# Altium project CW313_20pinToTarget.PrjPcb
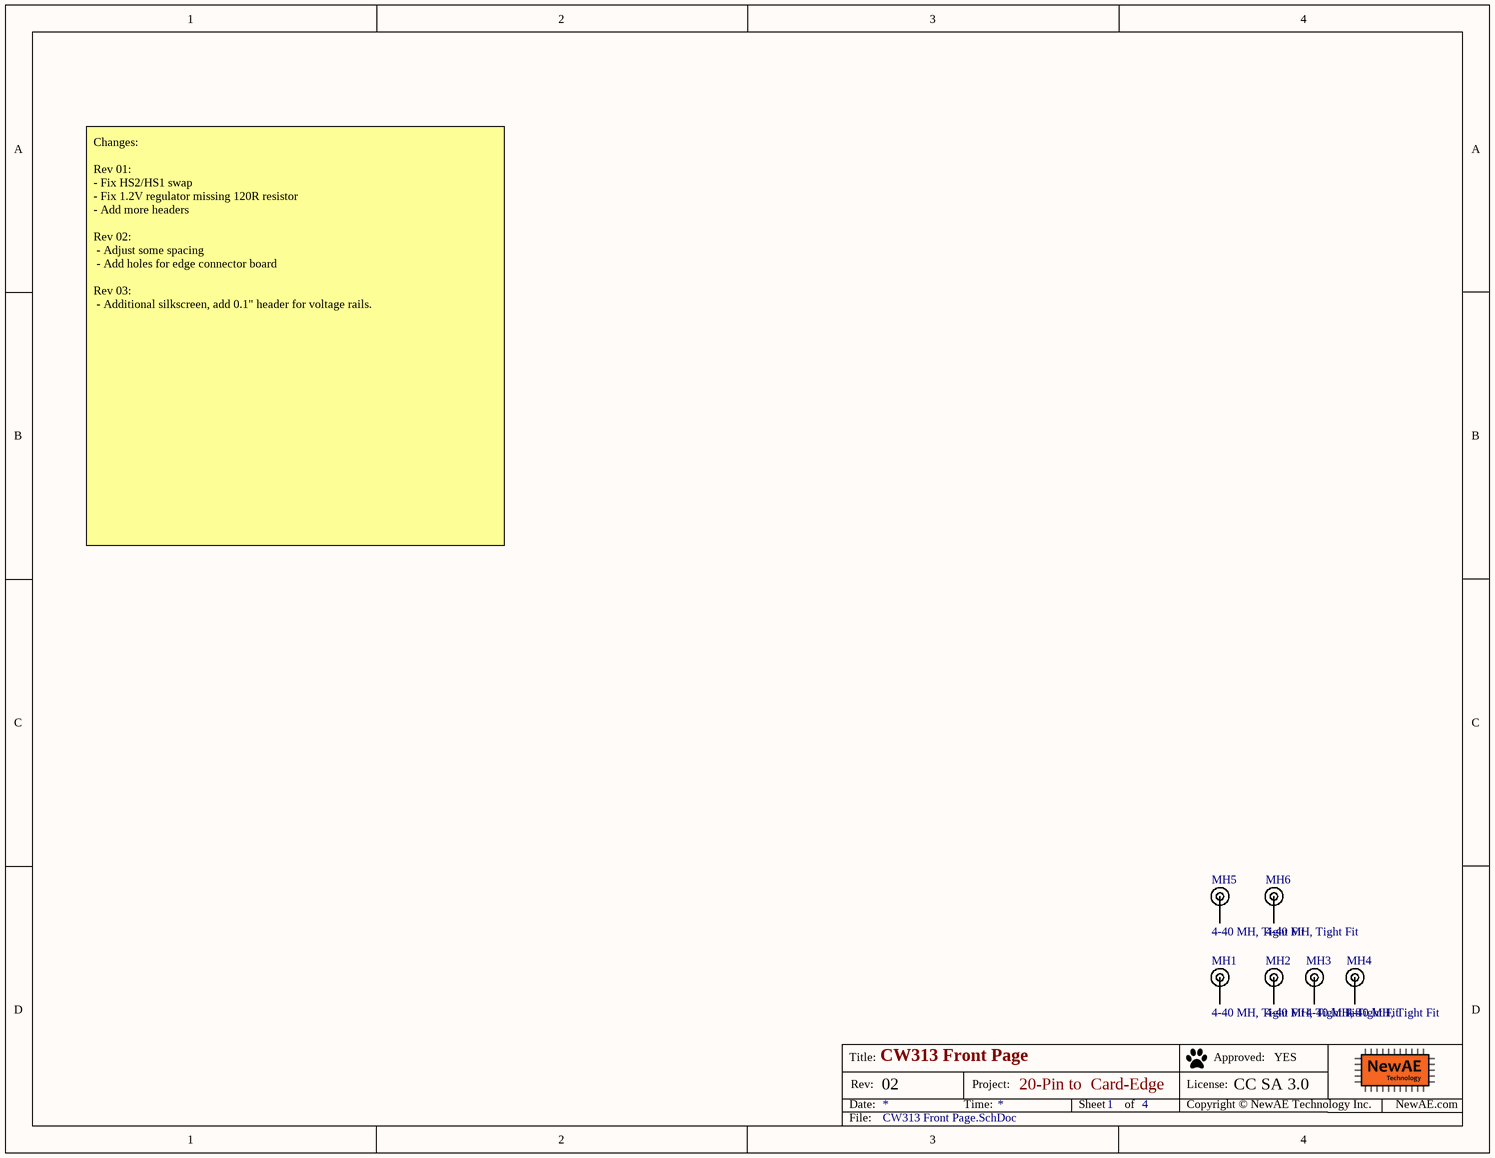
[diagram p0: CW313 Front Page.SchDoc]
PrjLicense: CC SA 3.0; PrjName: 20-Pin to  Card-Edge; PrjRev: 02
4 sheets, 81 parts. Net scope: global (net labels, ports and power ports of the same name join across sheets).
Board file: CW313.PcbDoc
Sheets:
  CW313 Front Page.SchDoc
  CW313 PCIe Edge.SchDoc
  CW313 Power Supplies.SchDoc
  CW313 20 Pin Connector.SchDoc

## Sheet CW313 Front Page.SchDoc: CW313 Front Page
size Letter; Organization: NewAE Technology Inc.; Address1: 1083 Queen St., Suite 196; Address2: Halifax; Address3: NS; Address4: Canada B3H 0B2; SheetNumber: 1; SheetTotal: 4; SheetApproved: YES

### Parts
MH1  4-40 MH, Tight Fit  [MOUNT_#4_TIGHT]
MH2  4-40 MH, Tight Fit  [MOUNT_#4_TIGHT]
MH3  4-40 MH, Tight Fit  [MOUNT_#4_TIGHT]
MH4  4-40 MH, Tight Fit  [MOUNT_#4_TIGHT]
MH5  4-40 MH, Tight Fit  [MOUNT_#4_TIGHT]
MH6  4-40 MH, Tight Fit  [MOUNT_#4_TIGHT]

### Nets

Not connected (* = marked no-connect by the designer): MH1 1; MH2 1; MH3 1; MH4 1; MH5 1; MH6 1

### Notes on the sheet
- Changes:
  Rev 01:
  - Fix HS2/HS1 swap
  - Fix 1.2V regulator missing 120R resistor
  - Add more headers
  Rev 02:
  - Adjust some spacing
  - Add holes for edge connector board
  Rev 03:
  - Additional silkscreen, add 0.1" header for voltage rails.
- Title:
- Date:
- Rev:
- Time:
- Project:
- Sheet
- of
- License:
- Copyright © NewAE Technology Inc.
- Approved:
- NewAE.com
- File:

### Library data of the parts
MH1-MH6 = MOUNT_#4_TIGHT: Machine screw 4-40 Mounting Hole; Component Group: Mechanical; PP Material Stack: 0; Part Number: MOUNT_#4_TIGHT; Pin Count: 1; Component Kind: Mechanical; Component Type: Mechanical; PP Rotation: 0

## Sheet CW313 PCIe Edge.SchDoc: Card Edge Connector + Headers
size Letter; Organization: NewAE Technology Inc.; Address1: 1083 Queen St., Suite 196; Address2: Halifax; Address3: NS; Address4: Canada B3H 0B2; SheetNumber: 2; SheetTotal: 4; SheetApproved: Yes
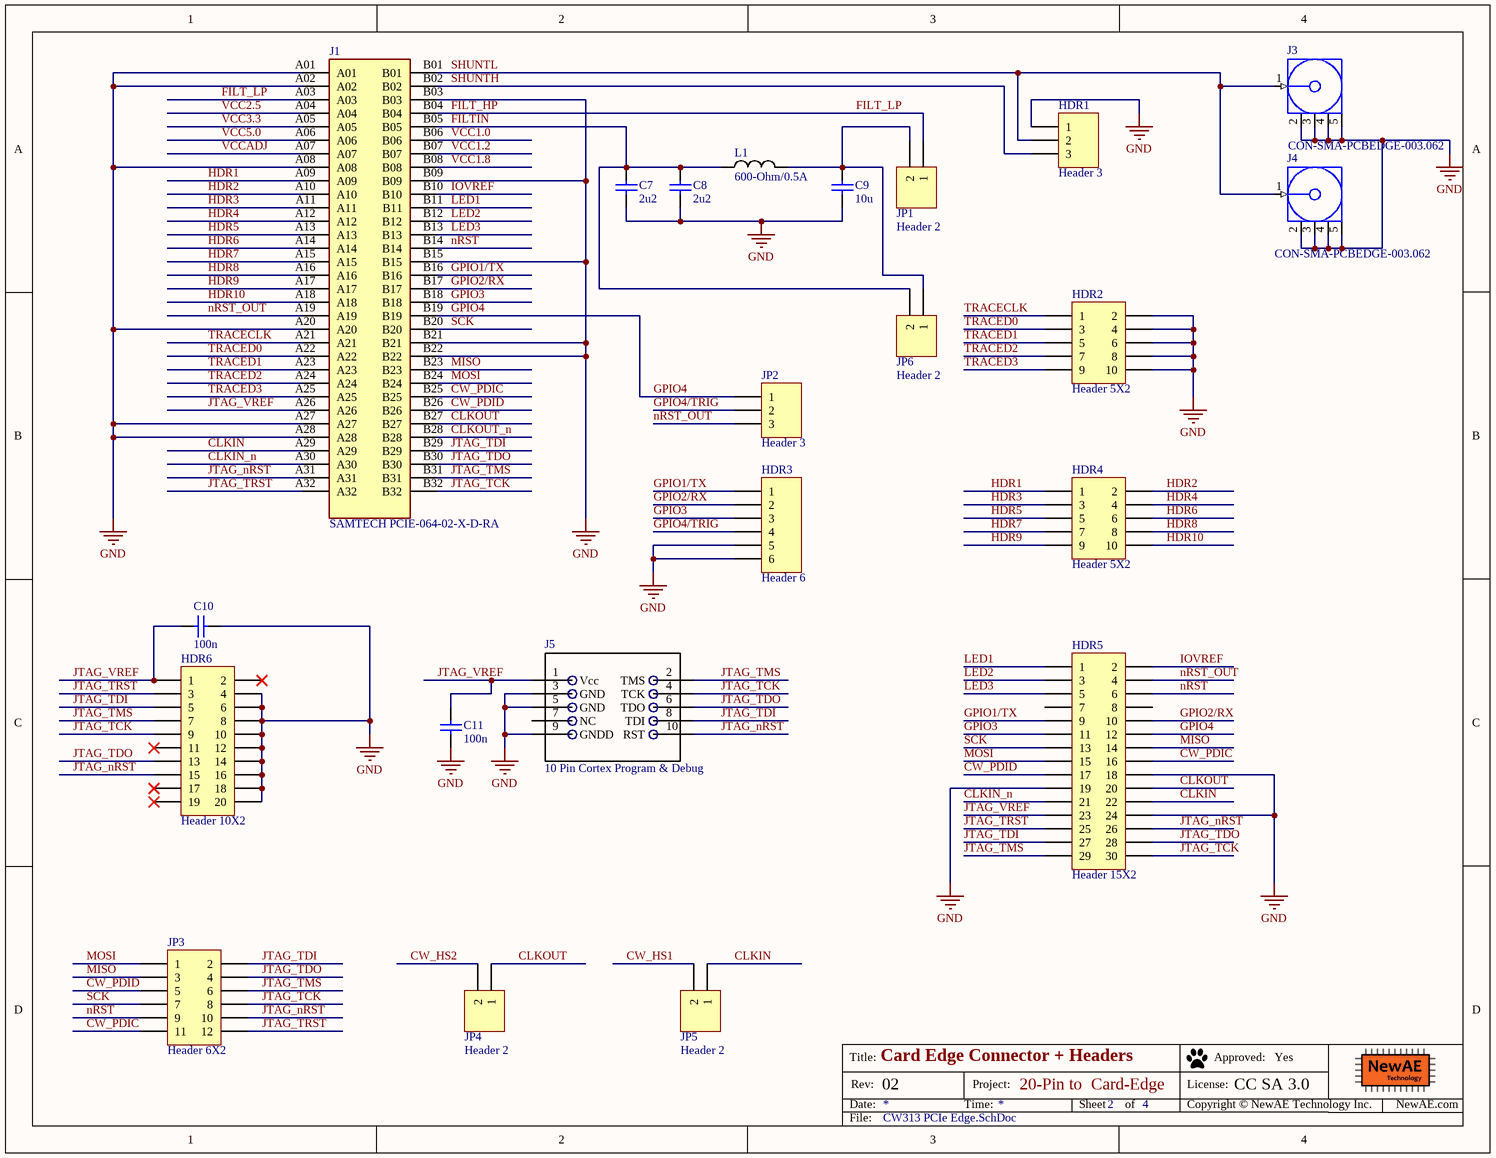
[diagram p1: CW313 PCIe Edge.SchDoc]

### Parts
C7  2u2  [CAPC0603_M]
C8  2u2  [CAPC0603_M]
C9  10u  [CAPC1206_M]
C10  100n  [CAPC0603_M]
C11  100n  [CAPC0603_M]
HDR1  Header 3  [HDR1X3]
HDR2  Header 5X2  [HDR2X5]
HDR3  Header 6  [HDR1X6]
HDR4  Header 5X2  [HDR2X5]
HDR5  Header 15X2  [HDR2X15]
HDR6  Header 10X2  [HDR2X10]
J1  SAMTECH PCIE-064-02-X-D-RA  [SAMTEC_PCIE-064-02-X-D-RA]
J3  CON-SMA-PCBEDGE-003.062  [CON-SMAM-PCB-EDGE062]
J4  CON-SMA-PCBEDGE-003.062  [CON-SMAM-PCB-EDGE062]
J5  10 Pin Cortex Program & Debug  [0.5mm_SMD_Header_5x2]
JP1  Header 2  [HDR1X2]
JP2  Header 3  [HDR1X3]
JP3  Header 6X2  [HDR2X6]
JP4  Header 2  [HDR1X2]
JP5  Header 2  [HDR1X2]
JP6  Header 2  [HDR1X2]
L1  600-Ohm/0.5A  [IND_0603]

### Nets
GND: C7.2 C8.2 C9.2 C10.2 C11.2 HDR1.1 HDR2.2 HDR2.4 HDR2.6 HDR2.8 HDR2.10 HDR3.5 HDR3.6 HDR5.18 HDR5.19 HDR5.24 HDR6.4 HDR6.6 HDR6.8 HDR6.10 HDR6.12 HDR6.14 HDR6.16 HDR6.18 HDR6.20 J1.A01 J1.A02 J1.A08 J1.A20 J1.A27 J1.A28 J1.B03 J1.B09 J1.B15 J1.B21 J1.B22 J3.2(GND) J3.3(GND) J3.4(GND) J3.5(GND) J4.2(GND) J4.3(GND) J4.4(GND) J4.5(GND) J5.3(GND) J5.5(GND) J5.9(GNDD)
VCC3.3: J1.A05
CLKIN: HDR5.22 J1.A29 JP5.1
CLKIN_n: HDR5.21 J1.A30
CLKOUT: HDR5.20 J1.B27 JP4.1
CLKOUT_n: J1.B28
CW_HS1: JP5.2
CW_HS2: JP4.2
CW_PDIC: HDR5.16 J1.B25 JP3.11
CW_PDID: HDR5.17 J1.B26 JP3.5
FILT_HP: J1.A03 J1.B04 JP1.1  [also labelled FILT_LP]
FILTIN: C7.1 C8.1 J1.B05 JP6.2 L1.1
GPIO1/TX: HDR3.1 HDR5.9 J1.B16
GPIO2/RX: HDR3.2 HDR5.10 J1.B17
GPIO3: HDR3.3 HDR5.11 J1.B18
GPIO4: HDR5.12 J1.B19 JP2.1
GPIO4/TRIG: HDR3.4 JP2.2
HDR1: HDR4.1 J1.A09
HDR2: HDR4.2 J1.A10
HDR3: HDR4.3 J1.A11
HDR4: HDR4.4 J1.A12
HDR5: HDR4.5 J1.A13
HDR6: HDR4.6 J1.A14
HDR7: HDR4.7 J1.A15
HDR8: HDR4.8 J1.A16
HDR9: HDR4.9 J1.A17
HDR10: HDR4.10 J1.A18
IOVREF: HDR5.2 J1.B10
JTAG_nRST: HDR5.26 HDR6.15 J1.A31 J5.10(RST) JP3.10
JTAG_TCK: HDR5.30 HDR6.9 J1.B32 J5.4(TCK) JP3.8
JTAG_TDI: HDR5.27 HDR6.5 J1.B29 J5.8(TDI) JP3.2
JTAG_TDO: HDR5.28 HDR6.13 J1.B30 J5.6(TDO) JP3.4
JTAG_TMS: HDR5.29 HDR6.7 J1.B31 J5.2(TMS) JP3.6
JTAG_TRST: HDR5.25 HDR6.3 J1.A32 JP3.12
JTAG_VREF: C10.1 C11.1 HDR5.23 HDR6.1 J1.A26 J5.1(Vcc)
LED1: HDR5.1 J1.B11
LED2: HDR5.3 J1.B12
LED3: HDR5.5 J1.B13
MISO: HDR5.14 J1.B23 JP3.3
MOSI: HDR5.15 J1.B24 JP3.1
nRST: HDR5.6 J1.B14 JP3.9
nRST_OUT: HDR5.4 J1.A19 JP2.3
SCK: HDR5.13 J1.B20 JP3.7
SHUNTH: HDR1.3 J1.B02
SHUNTL: HDR1.2 J1.B01 J3.1(Signal) J4.1(Signal)
TRACECLK: HDR2.1 J1.A21
TRACED0: HDR2.3 J1.A22
TRACED1: HDR2.5 J1.A23
TRACED2: HDR2.7 J1.A24
TRACED3: HDR2.9 J1.A25
VCC1.0: J1.B06
VCC1.2: J1.B07
VCC1.8: J1.B08
VCC2.5: J1.A04
VCC5.0: J1.A06
VCCADJ: J1.A07
NetC9_1: C9.1 JP1.2 JP6.1 L1.2

Not connected (* = marked no-connect by the designer): HDR5 7 8; HDR6 2* 11* 17* 19*; J5 7(NC)

### Notes on the sheet
- Title:
- Date:
- Rev:
- Time:
- Project:
- Sheet
- of
- License:
- Copyright © NewAE Technology Inc.
- Approved:
- NewAE.com
- File:

### Library data of the parts
C7 C8 = CCHIP-2u2-0603-16V: 2u2, 0603; Manufacture 1: Taiyo Yuden; Manufacture Part Number 1: EMK107BJ225KA-T; Component Group: Capacitor; Case-EIA: 0603; Case-Metric: 1608; Rated Voltage: 16VDC; Part Number: CCHIP-2u2-0603-16V; Footprint: 0603; Pin Count: 2; Supplier 1: Digi-Key; Supplier Part Number 1: 587-1430-1-ND; Value: 2u2; Mounting Technology: SMT; Component Kind: Standard; Component Type: Standard
C9 = CCHIP-10u-1206: CAP CER 10UF 25V X7R 1206; Manufacture 1: Taiyo Yuden; Manufacture Part Number 1: TMK316AB7106KL-T; Component Group: Capacitor; Case-EIA: 1206; Case-Metric: 3216; Part Number: CCHIP-10u-1206; Footprint: 1206; Pin Count: 2; Supplier 1: Digi-Key; Supplier Part Number 1: 587-3486-1-ND; Value: 10u; Mounting Technology: SMT; Component Kind: Standard; Component Type: Standard
C10 C11 = CCHIP-100n-0603: 100n, 0603; Manufacture 1: Kemet; Manufacture Part Number 1: C0603C104K5RACTU; Component Group: Capacitor; Case-EIA: 0603; Case-Metric: 1608; Rated Voltage: 50VDC; Part Number: CCHIP-100n-0603; Footprint: 0603; Pin Count: 2; Supplier 1: Digi-Key; Supplier Part Number 1: 399-5089-2-ND; Value: 100n; Mounting Technology: SMT; Component Kind: Standard; Component Type: Standard
HDR1 JP2 = Header 3: Header, 3-Pin; LatestRevisionDate: 17-Jul-2002; LatestRevisionNote: Re-released for DXP Platform.; Publisher: Altium Limited
HDR2 HDR4 = Header 5X2: Header, 5-Pin, Dual row; LatestRevisionDate: 17-Jul-2002; LatestRevisionNote: Re-released for DXP Platform.; Publisher: Altium Limited
HDR3 = Header 6: Header, 6-Pin; LatestRevisionDate: 17-Jul-2002; LatestRevisionNote: Re-released for DXP Platform.; Publisher: Altium Limited
HDR5 = Header 15X2: Header, 15-Pin, Dual row; LatestRevisionDate: 17-Jul-2002; LatestRevisionNote: Re-released for DXP Platform.; Publisher: Altium Limited
HDR6 = Header 10X2: Header, 10-Pin, Dual row; LatestRevisionDate: 17-Jul-2002; LatestRevisionNote: Re-released for DXP Platform.; Publisher: Altium Limited
J1 = PCIE-064-02-S-D-RA: 1.00 mm PCI Express Edge Card Connector (Thick Gold); MF: Samtec; PP Material Stack: 0; Package: None; Value: *; Availability: Unavailable; MP: PCIE-064-02-X-D-RA; Price: None; Part Number: PCIE-064-02-S-D-RA; Component Group: Connector; Footprint: PCIE-064-02-X-D-RA; Manufacture 1: Samtech; Manufacture Part Number 1: PCIE-064-02-X-D-RA; Pin Count: 64; Supplier 1: Mouser; Mounting Technology: Through-hole; RoHS: Yes; Component Kind: Standard; Component Type: Standard; PP Rotation: 0; PP Rotation1: 0
J3 J4 = CON-SMA-PCBEDGE-003.062: SMA Female Edge Mount Connector for 0.062" Thick Board; Part Number: CON-SMA-PCBEDGE-003.062; Component Group: Connector; Pin Count: 5; ComponentLink1Description: Manufacturer URL; ComponentLink1URL: http://www.linxtechnologies.com/; ComponentLink2Description: Datasheet; ComponentLink2URL: http://www.connectorcity.com/diagrams/SMA/CONSMA003.062.pdf; Component Kind: Standard; Component Type: Standard
J5 = Cortex_Debug_Header_10Pin: 10 Pin Cortex Program & Debug 0.5mm pitch; Manufacture 1: Samtec Inc; Manufacture Part Number 1: FTSH-105-01-L-DV-007-K; Component Group: Connector; PP Material Stack: 0; Part Number: Cortex_Debug_Header_10Pin; Pin Count: 10; Supplier 1: Digi-Key; Supplier Part Number 1: SAM9438-ND; Mounting Technology: SMT; RoHS: Yes; Component Kind: Standard; Component Type: Standard; PP Rotation: 0
JP1 JP4-JP6 = Header 2: Header, 2-Pin; LatestRevisionDate: 17-Jul-2002; LatestRevisionNote: Re-released for DXP Platform.; Publisher: Altium Limited
JP3 = Header 6X2: Header, 6-Pin, Dual row; LatestRevisionDate: 17-Jul-2002; LatestRevisionNote: Re-released for DXP Platform.; Publisher: Altium Limited
L1 = FBCHIP-600R-0603: 600 Ohm @ 100 MHz, 0.5A rated FB; Manufacture 1: Murata Electronics; Manufacture Part Number 1: BLM18AG601SN1D; Component Group: Inductor; Value: 600R/0.5A; Case-EIA: 0603; Case-Metric: 1608; PP Material Stack: 0; Part Number: FBCHIP-600R-0603; Footprint: 0603; Pin Count: 2; Supplier 1: Digi-Key; Supplier Part Number 1: 490-1014-2-ND; Rated Power: 0.5A; Component Kind: Standard; Component Type: Standard; PP Rotation: 0

## Sheet CW313 Power Supplies.SchDoc: Power Supplies
size Letter; Organization: NewAE Technology Inc.; Address1: 1083 Queen St., Suite 196; Address2: Halifax; Address3: NS; Address4: Canada B3H 0B2; SheetNumber: 3; SheetTotal: 4; SheetApproved: YES
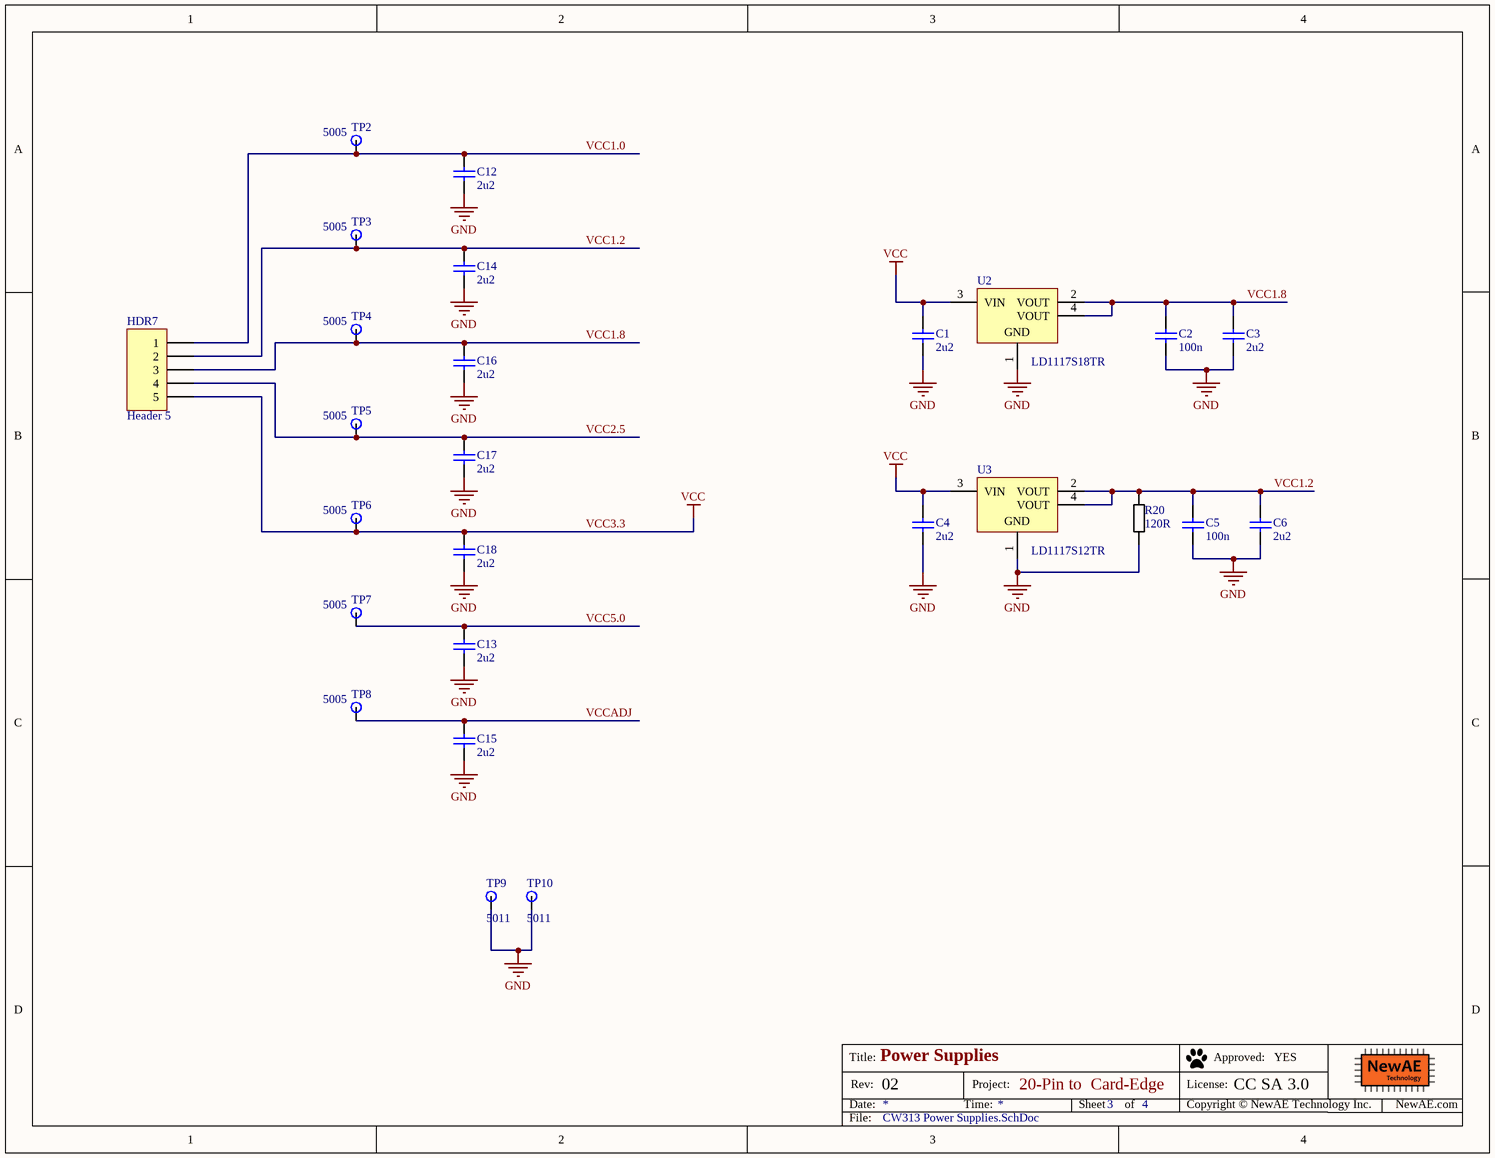
[diagram p2: CW313 Power Supplies.SchDoc]

### Parts
C1  2u2  [CAPC0603_M]
C2  100n  [CAPC0603_M]
C3  2u2  [CAPC0603_M]
C4  2u2  [CAPC0603_M]
C5  100n  [CAPC0603_M]
C6  2u2  [CAPC0603_M]
C12  2u2  [CAPC0603_M]
C13  2u2  [CAPC0603_M]
C14  2u2  [CAPC0603_M]
C15  2u2  [CAPC0603_M]
C16  2u2  [CAPC0603_M]
C17  2u2  [CAPC0603_M]
C18  2u2  [CAPC0603_M]
HDR7  Header 5  [HDR1X5]
R20  120R  [RESC1608X55N]
TP2  5005  [KEYSTONE5008]
TP3  5005  [KEYSTONE5008]
TP4  5005  [KEYSTONE5008]
TP5  5005  [KEYSTONE5008]
TP6  5005  [KEYSTONE5008]
TP7  5005  [KEYSTONE5008]
TP8  5005  [KEYSTONE5008]
TP9  5011  [KEYSTONE5011]
TP10  5011  [KEYSTONE5011]
U2  LD1117S18TR  [SOT-223_M]
U3  LD1117S12TR  [SOT-223_M]

### Nets
GND: C1.2 C2.2 C3.2 C4.2 C5.2 C6.2 C12.2 C13.2 C14.2 C15.2 C16.2 C17.2 C18.2 R20.2 TP9.1 TP10.1 U2.1(GND) U3.1(GND)
VCC3.3: C1.1 C4.1 C18.1 HDR7.5 TP6.1 U2.3(VIN) U3.3(VIN)  [also labelled VCC]
VCC1.0: C12.1 HDR7.1 TP2.1
VCC1.2: C5.1 C6.1 C14.1 HDR7.2 R20.1 TP3.1 U3.2(VOUT) U3.4(VOUT)
VCC1.8: C2.1 C3.1 C16.1 HDR7.3 TP4.1 U2.2(VOUT) U2.4(VOUT)
VCC2.5: C17.1 HDR7.4 TP5.1
VCC5.0: C13.1 TP7.1
VCCADJ: C15.1 TP8.1

### Notes on the sheet
- Title:
- Date:
- Rev:
- Time:
- Project:
- Sheet
- of
- License:
- Copyright © NewAE Technology Inc.
- Approved:
- NewAE.com
- File:

### Library data of the parts
C1 C3 C4 C6 C12-C18 = CCHIP-2u2-0603-16V: as C7 on sheet CW313 PCIe Edge; Part Number: CCHIP-2u2-0603-16V; Footprint: 0603; Pin Count: 2; Supplier 1: Digi-Key; Supplier Part Number 1: 587-1430-1-ND; Value: 2u2; Mounting Technology: SMT; Component Kind: Standard; Component Type: Standard
C2 C5 = CCHIP-100n-0603: as C10 on sheet CW313 PCIe Edge; Part Number: CCHIP-100n-0603; Footprint: 0603; Pin Count: 2; Supplier 1: Digi-Key; Supplier Part Number 1: 399-5089-2-ND; Value: 100n; Mounting Technology: SMT; Component Kind: Standard; Component Type: Standard
HDR7 = Header 5: Header, 5-Pin; LatestRevisionDate: 17-Jul-2002; LatestRevisionNote: Re-released for DXP Platform.; Publisher: Altium Limited
R20 = RCHIP-120R-0603: 120R res, 0603, 1%, 1/10W; Manufacture 1: Yageo; Manufacture Part Number 1: RC0603FR-07120RL; Component Group: Resistor; Case-EIA: 0603; Case-Metric: 1608; Rated Power: 0.1W; Rated Voltage: 75VDC; Part Number: RCHIP-120R-0603; Footprint: 0603; Pin Count: 2; Supplier 1: Digi-Key; Supplier Part Number 1: 311-120HRCT-ND; Value: 120R; Tolerance: 1%; Mounting Technology: SMT; Temperature Range: -55C to 155C; Component Kind: Standard; Component Type: Standard
TP2-TP8 = KEYSTONE_5005: TEST POINT PC COMPACT .063"D RED; Part Number: KEYSTONE_5005; Component Group: Test Point; Pin Count: 1; Supplier 1: Digi-Key; Supplier Part Number 1: 36-5008-ND; Mounting Technology: Through-hole; Component Kind: Standard; Component Type: Standard
TP9 TP10 = KEYSTONE_5011: TEST POINT PC MULTI PURPOSE BLK; Part Number: KEYSTONE_5011; Component Group: Test Point; Pin Count: 1; Supplier 1: Digi-Key; Supplier Part Number 1: 36-5011-ND; Mounting Technology: Through-hole; Component Kind: Standard; Component Type: Standard
U2 = CMP-0244-00308-1: Fixed Low Drop Positive Voltage Regulator, 1.8V, 4-Pin SOT-223, Tape and Reel; ComponentLink1URL: http://www.st.com; PackageReference: SOT-223; PackageDescription: 4-Pin SOT-223 Package, 6.5 x 3.5 mm Body, 2.3 mm Pitch, 7 mm Lead Span; ComponentLink2URL: http://www.st.com/internet/com/TECHNICAL_RESOURCES/TECHNICAL_LITERATURE/DATASHEET/CD00000544.pdf; ComponentLink2Description: Datasheet; ComponentLink1Description: Manufacturer URL; DatasheetVersion: 1/11/2011; PackageVersion: 2010; Supplier 1: Digi-Key; Supplier Part Number 1: 497-7308-1-ND
U3 = CMP-0244-00318-1: Fixed Low Drop Positive Voltage Regulator, 1.2V, 4-Pin SOT-223, Tape and Reel; PackageDescription: 4-Pin SOT-223 Package, 6.5 x 3.5 mm Body, 2.3 mm Pitch, 7 mm Lead Span; PackageVersion: 2010; ComponentLink2Description: Datasheet; PackageReference: SOT-223; ComponentLink2URL: http://www.st.com/internet/com/TECHNICAL_RESOURCES/TECHNICAL_LITERATURE/DATASHEET/CD00000544.pdf; ComponentLink1Description: Manufacturer URL; DatasheetVersion: 1/11/2011; ComponentLink1URL: http://www.st.com; Supplier 1: Digi-Key; Supplier Part Number 1: 497-4240-1-ND

## Sheet CW313 20 Pin Connector.SchDoc: 20-Pin Connector
size Letter; Organization: NewAE Technology Inc.; Address1: 1083 Queen St., Suite 196; Address2: Halifax; Address3: NS; Address4: Canada B3H 0B2; SheetNumber: 4; SheetTotal: 4; SheetApproved: YES
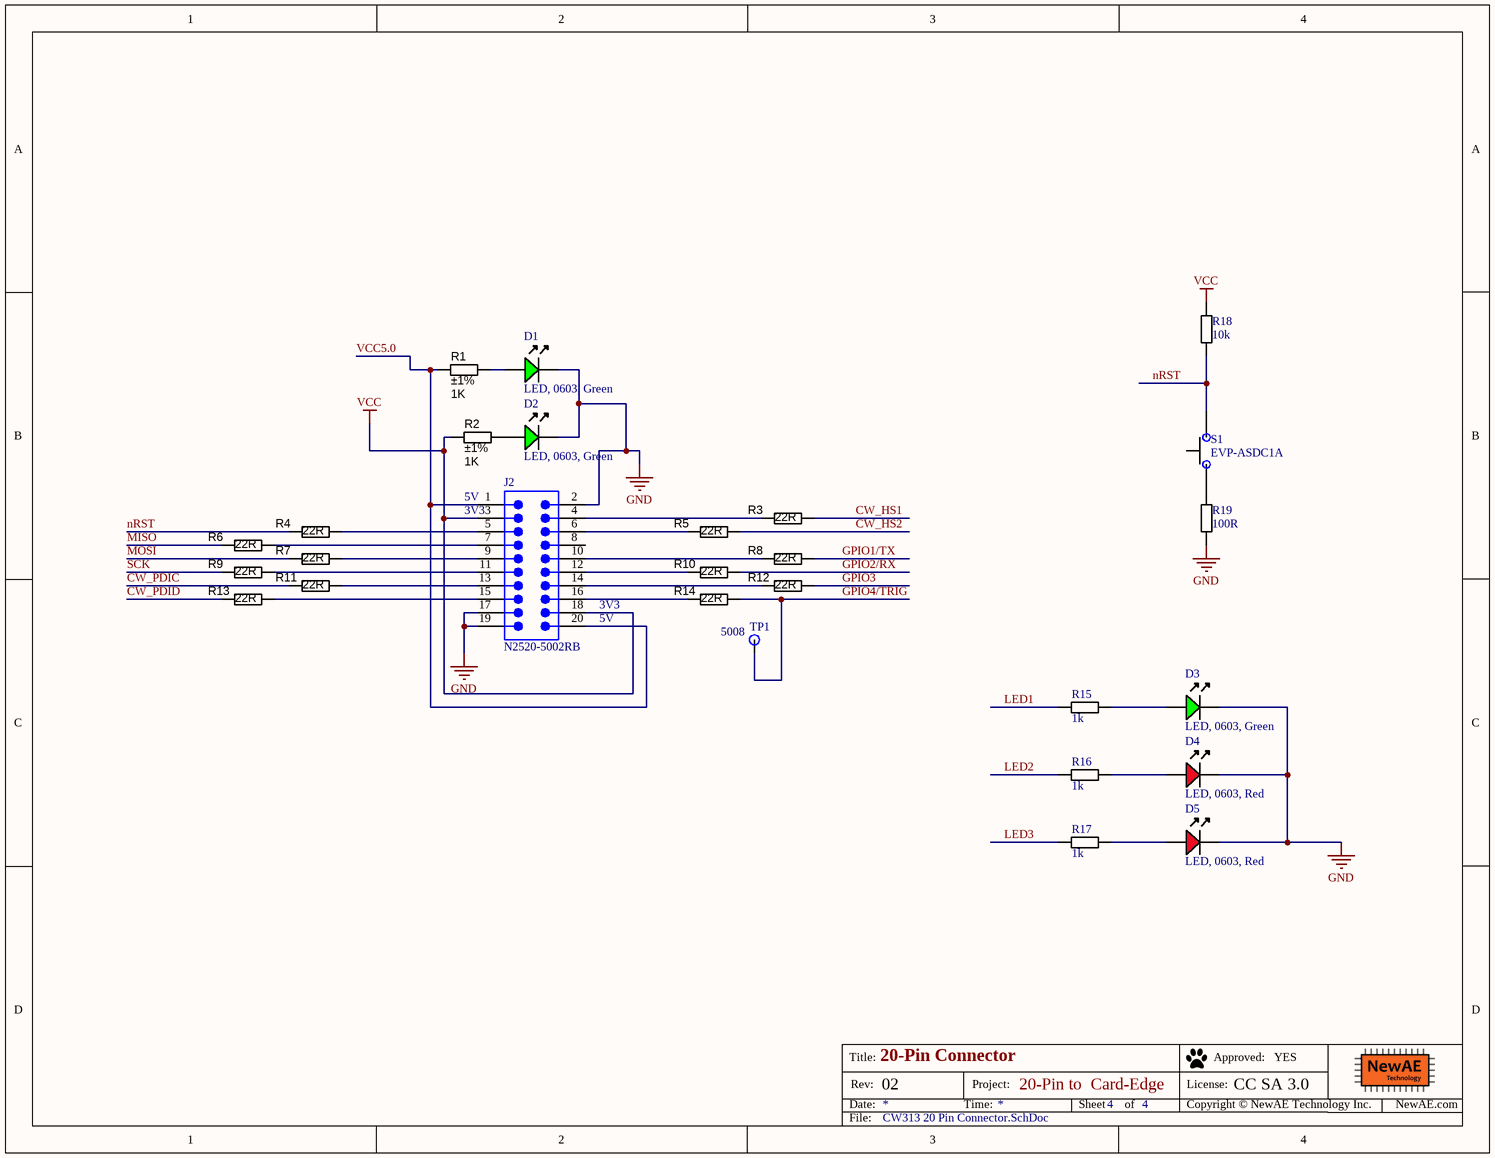
[diagram p3: CW313 20 Pin Connector.SchDoc]

### Parts
D1  LED, 0603, Green  [LED-0603-GREEN]
D2  LED, 0603, Green  [LED-0603-GREEN]
D3  LED, 0603, Green  [LED-0603-GREEN]
D4  LED, 0603, Red  [LED-0603-RED]
D5  LED, 0603, Red  [LED-0603-RED]
J2  N2520-5002RB  [NAE-PCB-CW-1000-0001-01]
R1  value 1K  Tolerance: ±1%  [RESC1608X55N]  (hidden comment: Thick Film)
R2  value 1K  Tolerance: ±1%  [RESC1608X55N]  (hidden comment: Thick Film)
R3  value 22R  [RESC1608X55N]  (hidden comment: Thick Film)
R4  value 22R  [RESC1608X55N]  (hidden comment: Thick Film)
R5  value 22R  [RESC1608X55N]  (hidden comment: Thick Film)
R6  value 22R  [RESC1608X55N]  (hidden comment: Thick Film)
R7  value 22R  [RESC1608X55N]  (hidden comment: Thick Film)
R8  value 22R  [RESC1608X55N]  (hidden comment: Thick Film)
R9  value 22R  [RESC1608X55N]  (hidden comment: Thick Film)
R10  value 22R  [RESC1608X55N]  (hidden comment: Thick Film)
R11  value 22R  [RESC1608X55N]  (hidden comment: Thick Film)
R12  value 22R  [RESC1608X55N]  (hidden comment: Thick Film)
R13  value 22R  [RESC1608X55N]  (hidden comment: Thick Film)
R14  value 22R  [RESC1608X55N]  (hidden comment: Thick Film)
R15  1k  [RESC1608X55N]
R16  1k  [RESC1608X55N]
R17  1k  [RESC1608X55N]
R18  10k  [RESC1608X55N]
R19  100R  [RESC1608X55N]
S1  EVP-ASDC1A  [EVPAS]
TP1  5008  [KEYSTONE5008]

### Nets
GND: D1.K D2.K D3.K D4.K D5.K J2.2 J2.17 J2.19 R19.2
VCC: J2.3 J2.18 R2.2 R18.1  [project net VCC3.3]
CW_HS1: R3.2
CW_HS2: R5.2
CW_PDIC: R11.1
CW_PDID: R13.1
GPIO1/TX: R8.2
GPIO2/RX: R10.2
GPIO3: R12.2
GPIO4/TRIG: R14.2 TP1.1
LED1: R15.1
LED2: R16.1
LED3: R17.1
MISO: R6.1
MOSI: R7.1
nRST: R4.1 R18.2 S1.2(IN)
SCK: R9.1
VCC5.0: J2.1 J2.20 R1.2
NetD1_A: D1.A R1.1
NetD2_A: D2.A R2.1
NetD3_A: D3.A R15.2
NetD4_A: D4.A R16.2
NetD5_A: D5.A R17.2
NetJ2_4: J2.4 R3.1
NetJ2_5: J2.5 R4.2
NetJ2_6: J2.6 R5.1
NetJ2_7: J2.7 R6.2
NetJ2_9: J2.9 R7.2
NetJ2_10: J2.10 R8.1
NetJ2_11: J2.11 R9.2
NetJ2_12: J2.12 R10.1
NetJ2_13: J2.13 R11.2
NetJ2_14: J2.14 R12.1
NetJ2_15: J2.15 R13.2
NetJ2_16: J2.16 R14.1
NetR19_1: R19.1 S1.1(IN)

Not connected (* = marked no-connect by the designer): J2 8

### Notes on the sheet
- (near J2) 5V
- (near J2) 3V3
- Title:
- Date:
- Rev:
- Time:
- Project:
- Sheet
- of
- License:
- Copyright © NewAE Technology Inc.
- Approved:
- NewAE.com
- File:

### Library data of the parts
D1-D3 = LEDCHIP_0603_GREEN: Chip LED, Green; Manufacture 1: Kingbright; Manufacture Part Number 1: APT1608CGCK; Component Group: Optical; PP Material Stack: 16; PP Rotation: -90; Part Number: LEDCHIP_0603_GREEN; Pin Count: 2; Supplier 1: Digi-Key; Supplier Part Number 1: 754-1116-1-ND; Mounting Technology: SMT; Component Kind: Standard; Component Type: Standard
D4 D5 = LEDCHIP_0603_RED: Chip LED, Red; Manufacture 1: Kingbright; Manufacture Part Number 1: APT1608SRCPRV; Component Group: Optical; PP Material Stack: 15; PP Rotation: -90; Part Number: LEDCHIP_0603_RED; Pin Count: 2; Supplier 1: Digi-Key; Supplier Part Number 1: 754-1122-1-ND; Mounting Technology: SMT; Component Kind: Standard; Component Type: Standard
J2 = NAE-CW-1000-0001-01: 20 Pin R/A Shrouded Header; Manufacturer: 3M; Pitch: 2.54 mm; PackageReference: N2520-5002RB; PackageDescription: .100[2.54] High Temp Terminal Body (Board Stacking); Orientation: Vertical; RoHS: True; Temperature Range: -55 to 125 degC; Mounting Technology: Through-hole; PartNumber: N2520-5002RB; Supplier 1: Digi-Key; Supplier Part Number 1: MHE20K-ND
R1 R2 = RES_1K_0603_1%: Resistor SMD chip 1k Ohm 0.1W 1% 0603; Manufacturer 1: Yageo; Manufacturer Part Number 1: RC0603FR-071KL; Ratings: 1/10W; SCDType: spec; Package / Case: 0603 (1608 Metric); Supplier 1: Digi-Key; Supplier Part Number 1: 311-1.00KHRCT-ND
R3-R14 = RES_22R_0603_5%: Resistor SMD chip 22 Ohm 0.1W 5% 0603; Manufacturer 1: Yageo; Manufacturer Part Number 1: RC0603JR-0722RL; Ratings: 1/10W; SCDType: spec; Temperature Coefficient: ±100ppm/°C; Tolerance: ±5%; Package / Case: 0603 (1608 metric); Case: 0603 (1608 metric); Supplier 1: Digi-Key; Supplier Part Number 1: 311-22GRCT-ND; RoHS 1: RoHS Compliant; ComponentLink1URL: http://www.yageo.com/documents/recent/PYu-RC0603_51_RoHS_L_4.pdf; ComponentLink1Description: http://www.yageo.com/documents/recent/PYu-RC0603_51_RoHS_L_4.pdf; Supplier 2: Digi-Key; Supplier Part Number 2: 1276-5022-6-ND; Manufacturer 2: Samsung Electro-Mechanics America, Inc; Manufacturer Part Number 2: RC1608J220CS; RoHS 2: RoHS Compliant; ComponentLink2URL: http://www.samsungsem.com/servlet/FileDownload?filename=productcatalog/pdf/Chip_Resistor.pdf; ComponentLink2Description: http://www.samsungsem.com/servlet/FileDownload?filename=productcatalog/pdf/Chip_Resistor.pdf; Supplier 3: Digi-Key; Supplier Part Number 3: RMCF0603JT22R0DKR-ND; Manufacturer 3: Stackpole Electronics Inc; Manufacturer Part Number 3: RMCF0603JT22R0; RoHS 3: RoHS Compliant; ComponentLink3URL: http://www.seielect.com/Catalog/SEI-RMCF_RMCP.pdf; ComponentLink3Description: http://www.seielect.com/Catalog/SEI-RMCF_RMCP.pdf; Supplier 4: Digi-Key; Supplier Part Number 4: RHM22CGDKR-ND; Manufacturer 4: Rohm Semiconductor; Manufacturer Part Number 4: MCR03ERTJ220; RoHS 4: RoHS Compliant; ComponentLink4URL: http://rohmfs.rohm.com/en/products/databook/datasheet/passive/resistor/chip_resistor/mcr_g.pdf; ComponentLink4Description: http://rohmfs.rohm.com/en/products/databook/datasheet/passive/resistor/chip_resistor/mcr_g.pdf; Supplier 5: Digi-Key; Supplier Part Number 5: P22GDKR-ND; Manufacturer 5: Panasonic Electronic Components; Manufacturer Part Number 5: ERJ-3GEYJ220V; RoHS 5: RoHS Compliant; ComponentLink5URL: http://industrial.panasonic.com/www-cgi/jvcr13pz.cgi?E+PZ+3+AOA0001+ERJ3GEYJ220V+7+WW; ComponentLink5Description: http://industrial.panasonic.com/www-cgi/jvcr13pz.cgi?E+PZ+3+AOA0001+ERJ3GEYJ220V+7+WW
R15-R17 = RCHIP-1K-0603: 1k res, 0603, 1%, 1/10W; Manufacture 1: Yageo; Manufacture Part Number 1: RC0603FR-071KL; Component Group: Resistor; Case-EIA: 0603; Case-Metric: 1608; Rated Power: 0.1W; Rated Voltage: 75VDC; Part Number: RCHIP-1K-0603; Footprint: 0603; Pin Count: 2; Supplier 1: Digi-Key; Supplier Part Number 1: 311-1.00KHRCT-ND; Value: 1k; Tolerance: 1%; Mounting Technology: SMT; Temperature Range: -55C to 155C; Component Kind: Standard; Component Type: Standard
R18 = RCHIP-10K-0603: 10k res, 0603, 1%, 1/10W; Manufacture 1: Yageo; Manufacture Part Number 1: RC0603FR-0710KL; Component Group: Resistor; Case-EIA: 0603; Case-Metric: 1608; Rated Power: 0.1W; Rated Voltage: 75VDC; Part Number: RCHIP-10K-0603; Footprint: 0603; Pin Count: 2; Supplier 1: Digi-Key; Supplier Part Number 1: 311-10.0KHRCT-ND; Value: 10k; Tolerance: 1%; Mounting Technology: SMT; Temperature Range: -55C to 155C; Component Kind: Standard; Component Type: Standard
R19 = RCHIP-100R-0603: 100R res, 0603, 1%, 1/10W; Manufacture 1: Yageo; Manufacture Part Number 1: RC0603FR-07100RL; Component Group: Resistor; Case-EIA: 0603; Case-Metric: 1608; Rated Power: 0.1W; Rated Voltage: 75VDC; Part Number: RCHIP-100R-0603; Footprint: 0603; Pin Count: 2; Supplier 1: Digi-Key; Supplier Part Number 1: 311-100HRCT-ND; Value: 100R; Tolerance: 1%; Mounting Technology: SMT; Temperature Range: -55C to 155C; Component Kind: Standard; Component Type: Standard
S1 = EVP-ASDC1A: Pushbutton, SMD, 2.5NM force, NO; Manufacture 1: Panasonic; Component Group: Switch; Rated Power: 0.1W; Rated Voltage: 75VDC; Part Number: EVP-ASDC1A; Manufacture Part Number 1: EVP-ASDC1A; Pin Count: 2; Supplier 1: Digi-Key; Supplier Part Number 1: P16856CT-ND; Mounting Technology: SMT; Component Kind: Standard; Component Type: Standard
TP1 = KEYSTONE_5008: TEST POINT PC COMPACT .063"D ORG; Part Number: KEYSTONE_5008; Component Group: Test Point; Pin Count: 1; Supplier 1: Digi-Key; Supplier Part Number 1: 36-5008-ND; Mounting Technology: Through-hole; Component Kind: Standard; Component Type: Standard

## Nets that join several sheets
GND: CW313 PCIe Edge (47 pins), CW313 Power Supplies (18 pins), CW313 20 Pin Connector (9 pins)
VCC3.3: CW313 PCIe Edge (J1.A05), CW313 Power Supplies (7 pins), CW313 20 Pin Connector (J2.3 J2.18 R2.2 R18.1)
CW_HS1: CW313 PCIe Edge (JP5.2), CW313 20 Pin Connector (R3.2)
CW_HS2: CW313 PCIe Edge (JP4.2), CW313 20 Pin Connector (R5.2)
CW_PDIC: CW313 PCIe Edge (HDR5.16 J1.B25 JP3.11), CW313 20 Pin Connector (R11.1)
CW_PDID: CW313 PCIe Edge (HDR5.17 J1.B26 JP3.5), CW313 20 Pin Connector (R13.1)
GPIO1/TX: CW313 PCIe Edge (HDR3.1 HDR5.9 J1.B16), CW313 20 Pin Connector (R8.2)
GPIO2/RX: CW313 PCIe Edge (HDR3.2 HDR5.10 J1.B17), CW313 20 Pin Connector (R10.2)
GPIO3: CW313 PCIe Edge (HDR3.3 HDR5.11 J1.B18), CW313 20 Pin Connector (R12.2)
GPIO4/TRIG: CW313 PCIe Edge (HDR3.4 JP2.2), CW313 20 Pin Connector (R14.2 TP1.1)
LED1: CW313 PCIe Edge (HDR5.1 J1.B11), CW313 20 Pin Connector (R15.1)
LED2: CW313 PCIe Edge (HDR5.3 J1.B12), CW313 20 Pin Connector (R16.1)
LED3: CW313 PCIe Edge (HDR5.5 J1.B13), CW313 20 Pin Connector (R17.1)
MISO: CW313 PCIe Edge (HDR5.14 J1.B23 JP3.3), CW313 20 Pin Connector (R6.1)
MOSI: CW313 PCIe Edge (HDR5.15 J1.B24 JP3.1), CW313 20 Pin Connector (R7.1)
nRST: CW313 PCIe Edge (HDR5.6 J1.B14 JP3.9), CW313 20 Pin Connector (R4.1 R18.2 S1.2)
SCK: CW313 PCIe Edge (HDR5.13 J1.B20 JP3.7), CW313 20 Pin Connector (R9.1)
VCC1.0: CW313 PCIe Edge (J1.B06), CW313 Power Supplies (C12.1 HDR7.1 TP2.1)
VCC1.2: CW313 PCIe Edge (J1.B07), CW313 Power Supplies (8 pins)
VCC1.8: CW313 PCIe Edge (J1.B08), CW313 Power Supplies (7 pins)
VCC2.5: CW313 PCIe Edge (J1.A04), CW313 Power Supplies (C17.1 HDR7.4 TP5.1)
VCC5.0: CW313 PCIe Edge (J1.A06), CW313 Power Supplies (C13.1 TP7.1), CW313 20 Pin Connector (J2.1 J2.20 R1.2)
VCCADJ: CW313 PCIe Edge (J1.A07), CW313 Power Supplies (C15.1 TP8.1)